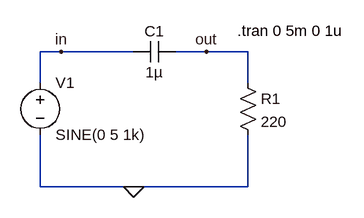
[diagram p0: schematic lab9 task01.asc]
lab9 task01.asc, the LTspice schematic file:
Version 4
SHEET 1 880 680
WIRE 32 112 0 112
WIRE 144 112 32 112
WIRE 256 112 208 112
WIRE 320 112 256 112
WIRE 0 160 0 112
WIRE 320 160 320 112
WIRE 0 320 0 240
WIRE 144 320 0 320
WIRE 320 320 320 240
WIRE 320 320 144 320
FLAG 144 320 0
FLAG 32 112 in
FLAG 256 112 out
SYMBOL voltage 0 144 R0
WINDOW 123 0 0 Left 0
WINDOW 39 0 0 Left 0
SYMATTR InstName V1
SYMATTR Value SINE(0 5 1k)
SYMBOL res 304 144 R0
SYMATTR InstName R1
SYMATTR Value 220
SYMBOL cap 208 96 R90
WINDOW 0 0 32 VBottom 2
WINDOW 3 32 32 VTop 2
SYMATTR InstName C1
SYMATTR Value 1µ
TEXT 304 80 Left 2 !.tran 0 5m 0 1u

The netlist it stands for:
* lab9 task01.asc
V1 in 0 SINE(0 5 1k)
R1 out 0 220
C1 out in 1µ
.tran 0 5m 0 1u
.backanno
.end